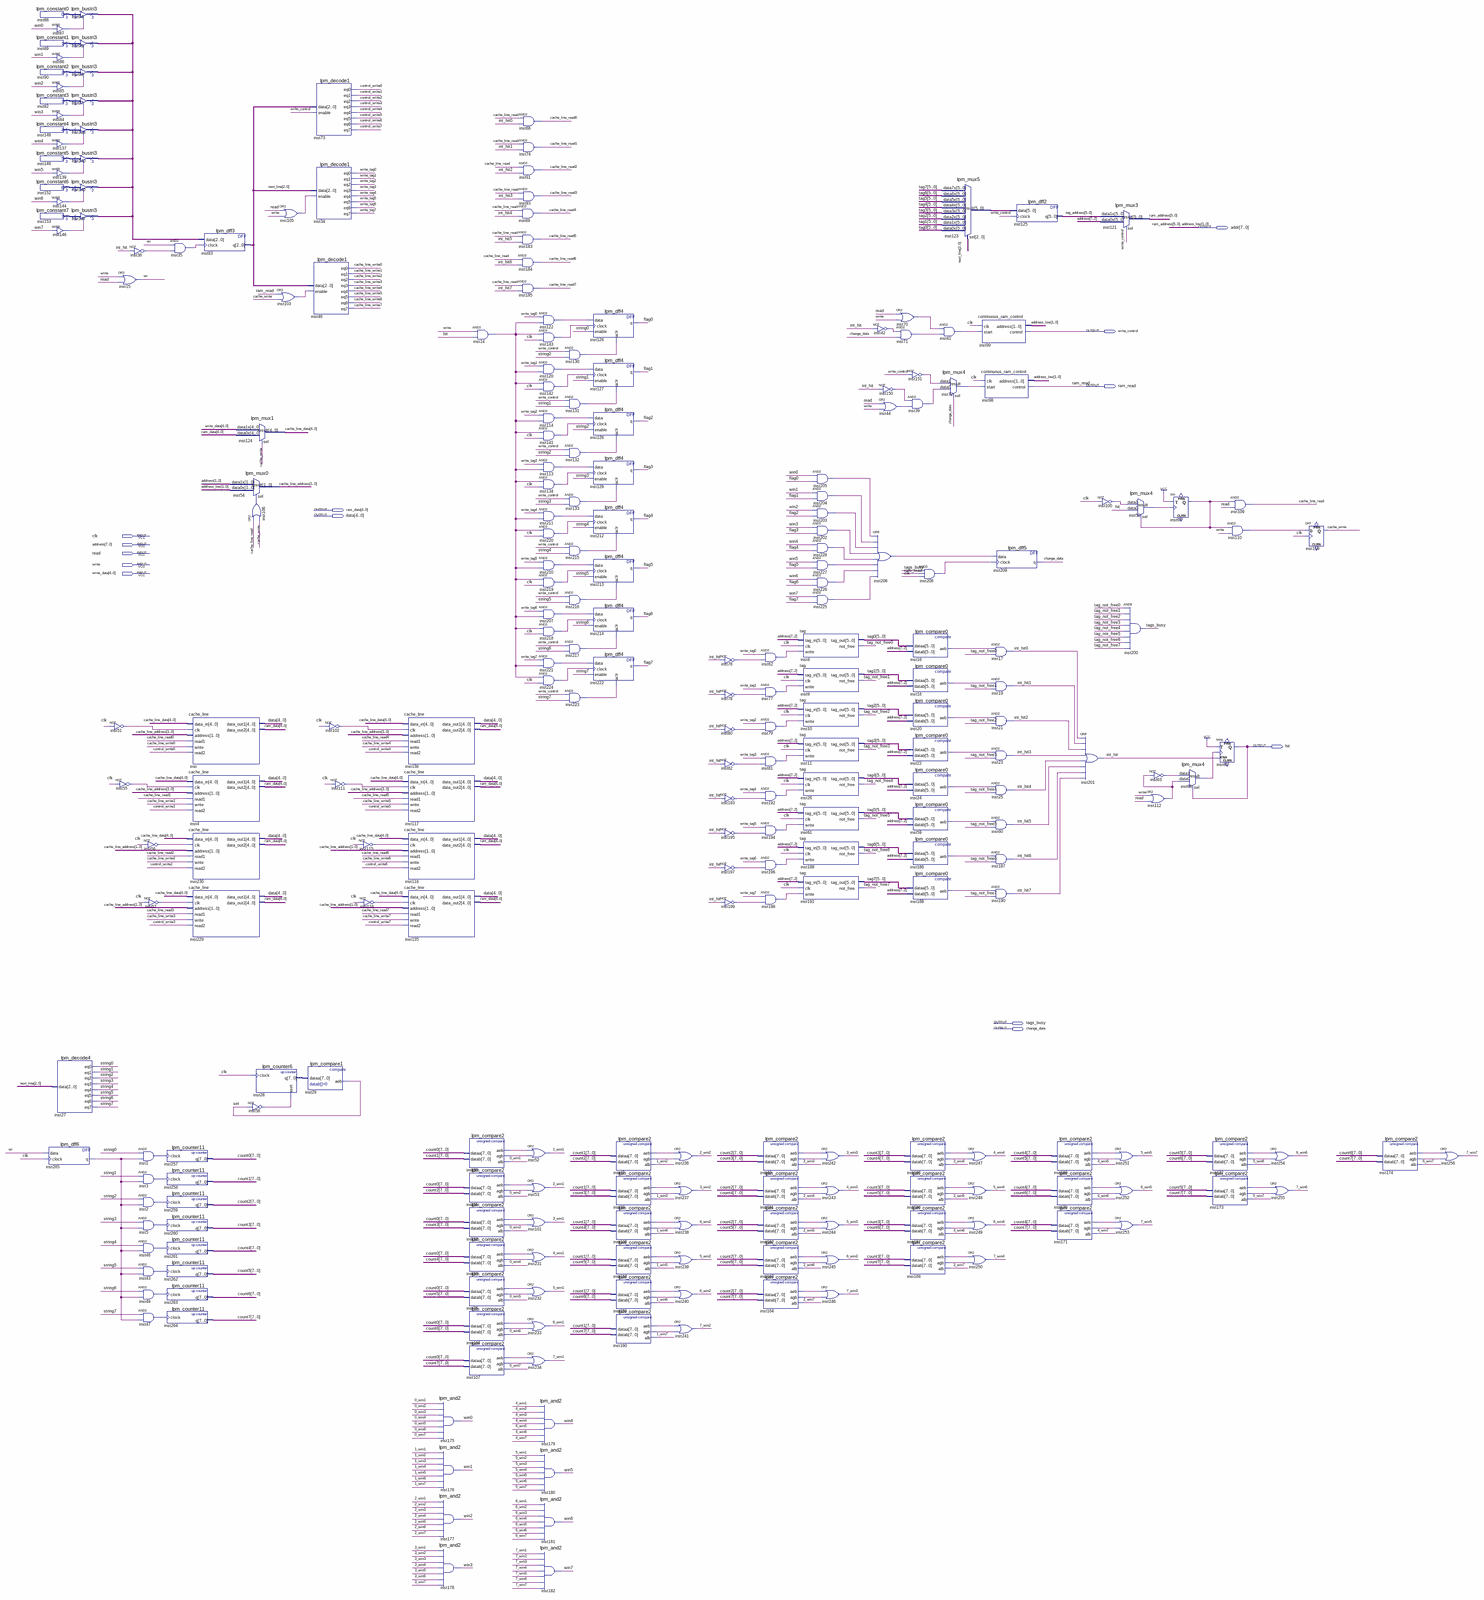
[diagram p0: schematic sheet, whole]
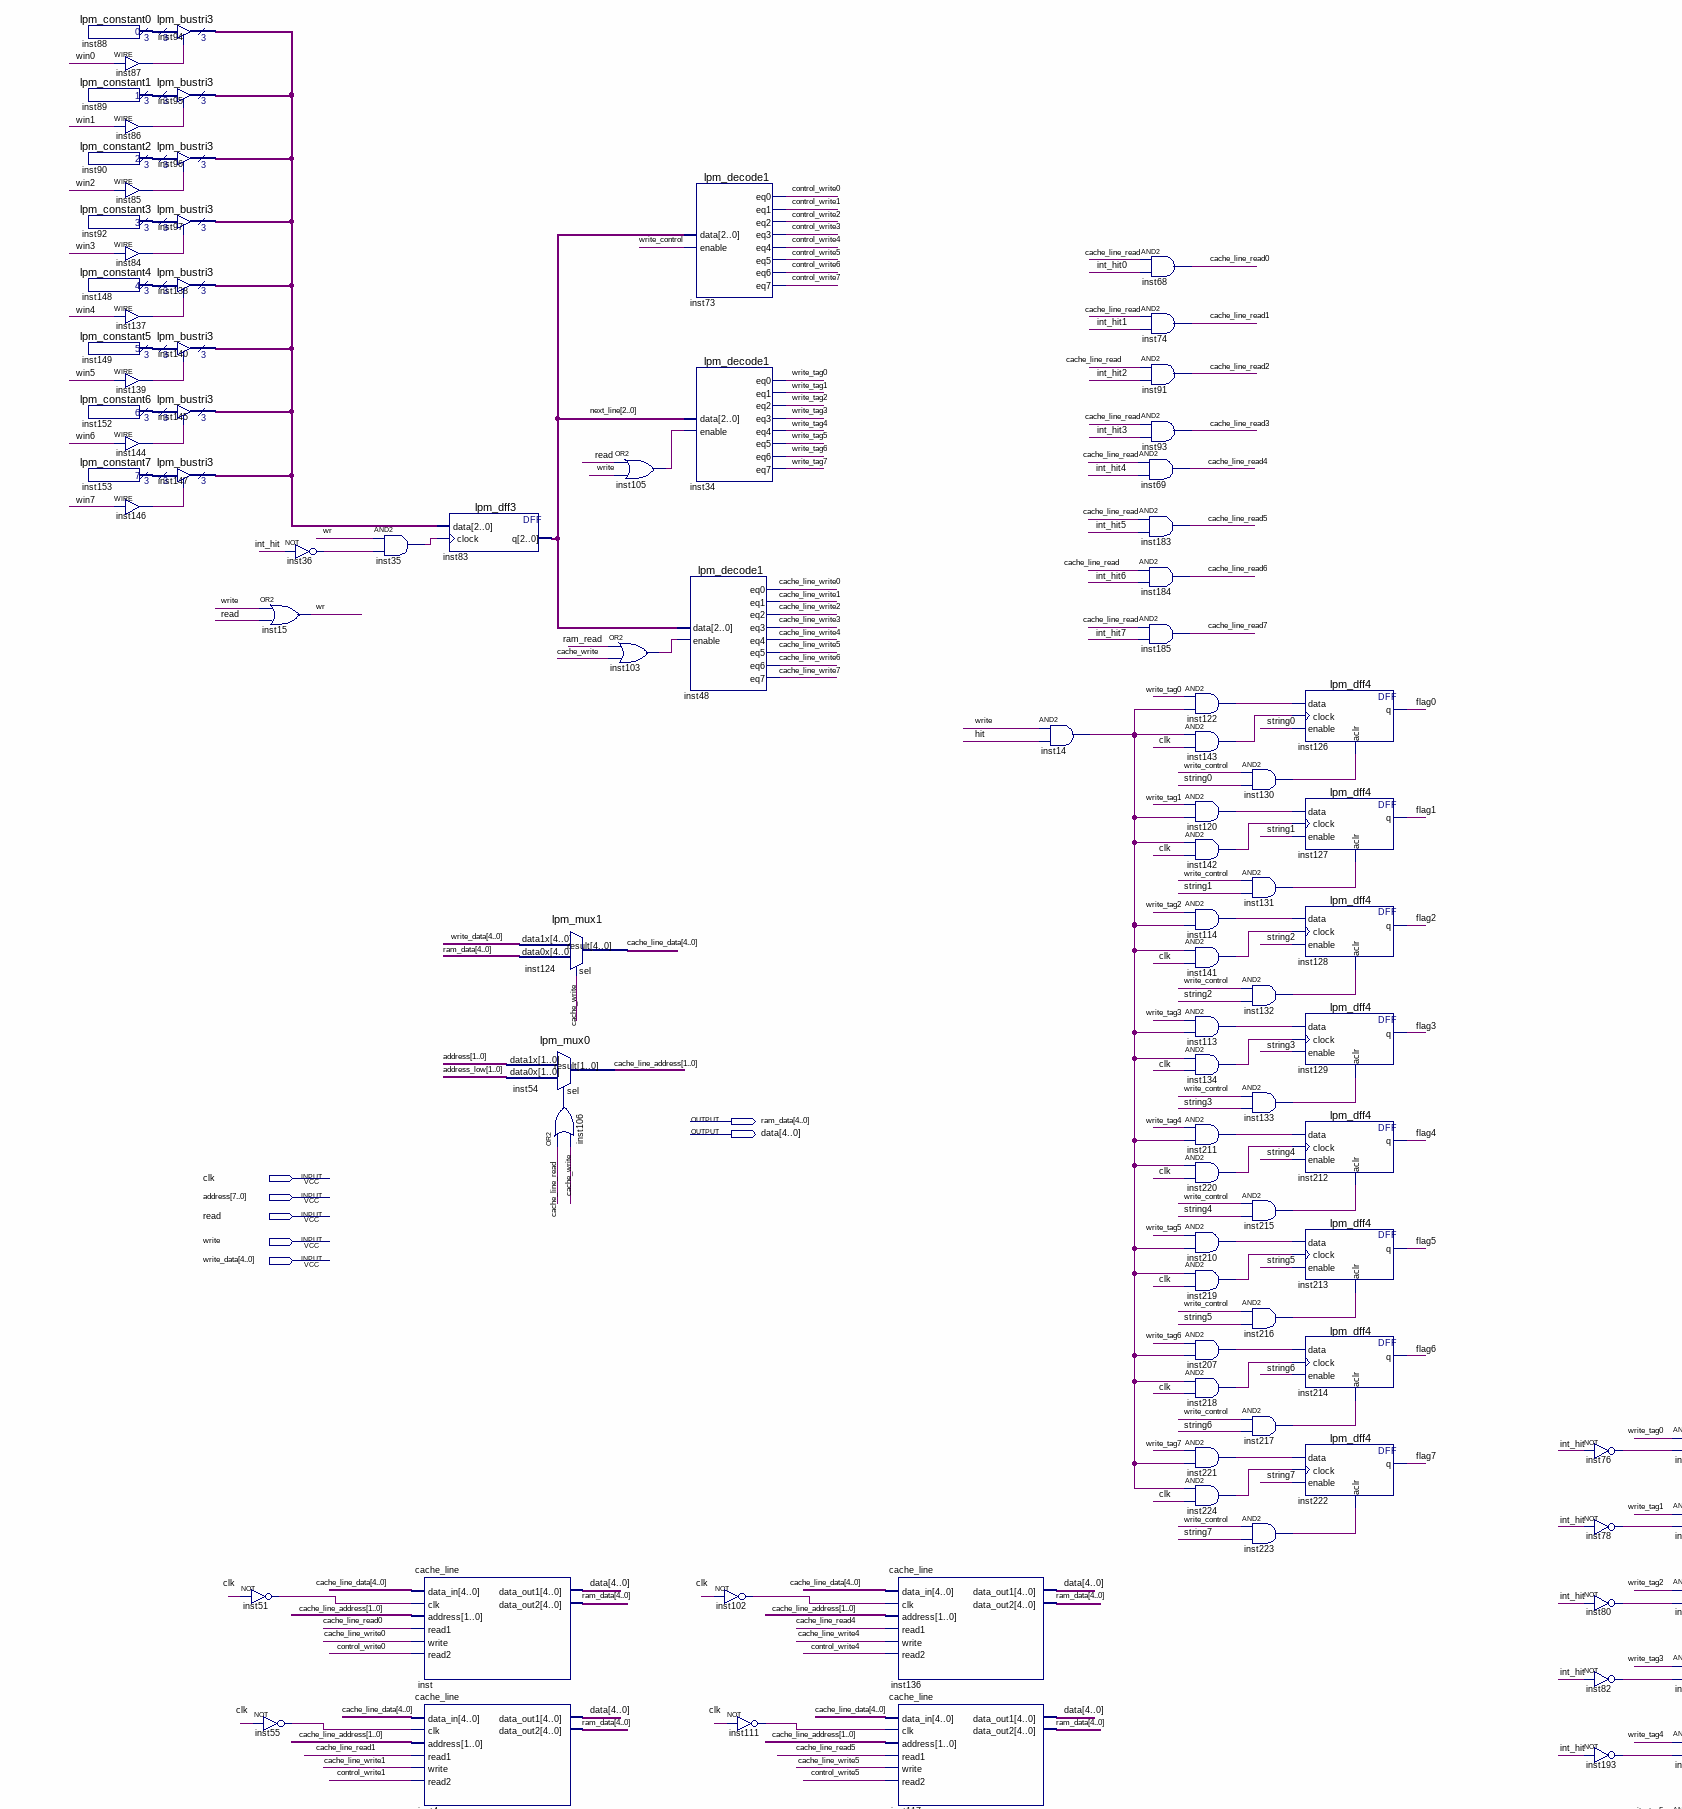
[diagram p1: schematic sheet, upper left part]
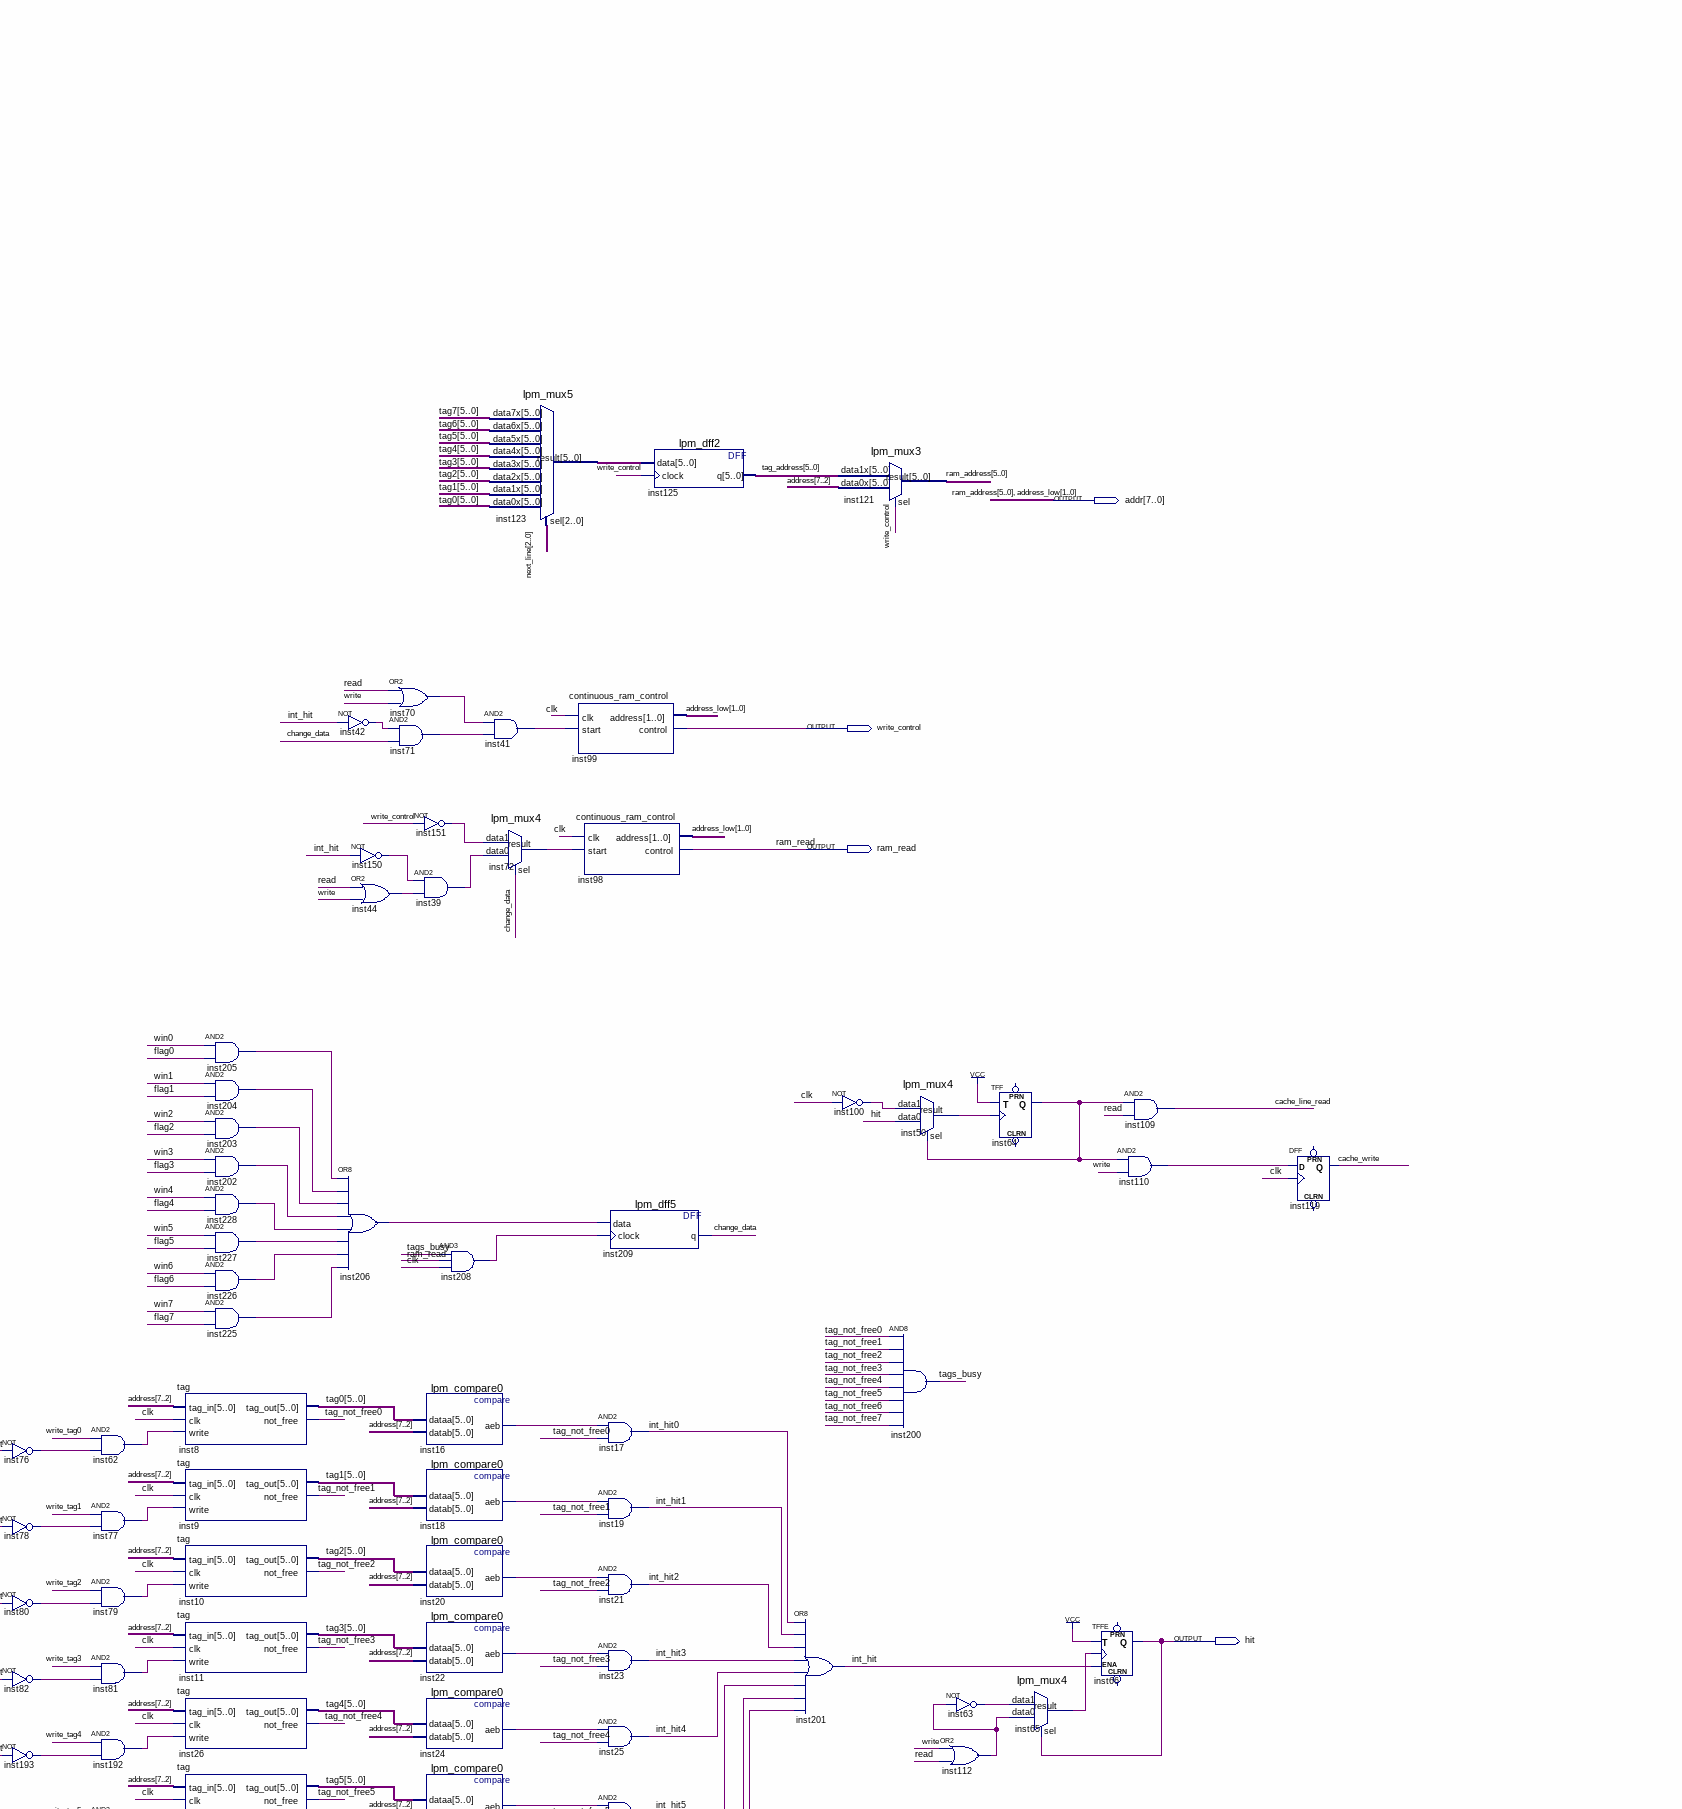
[diagram p2: schematic sheet, upper right part]
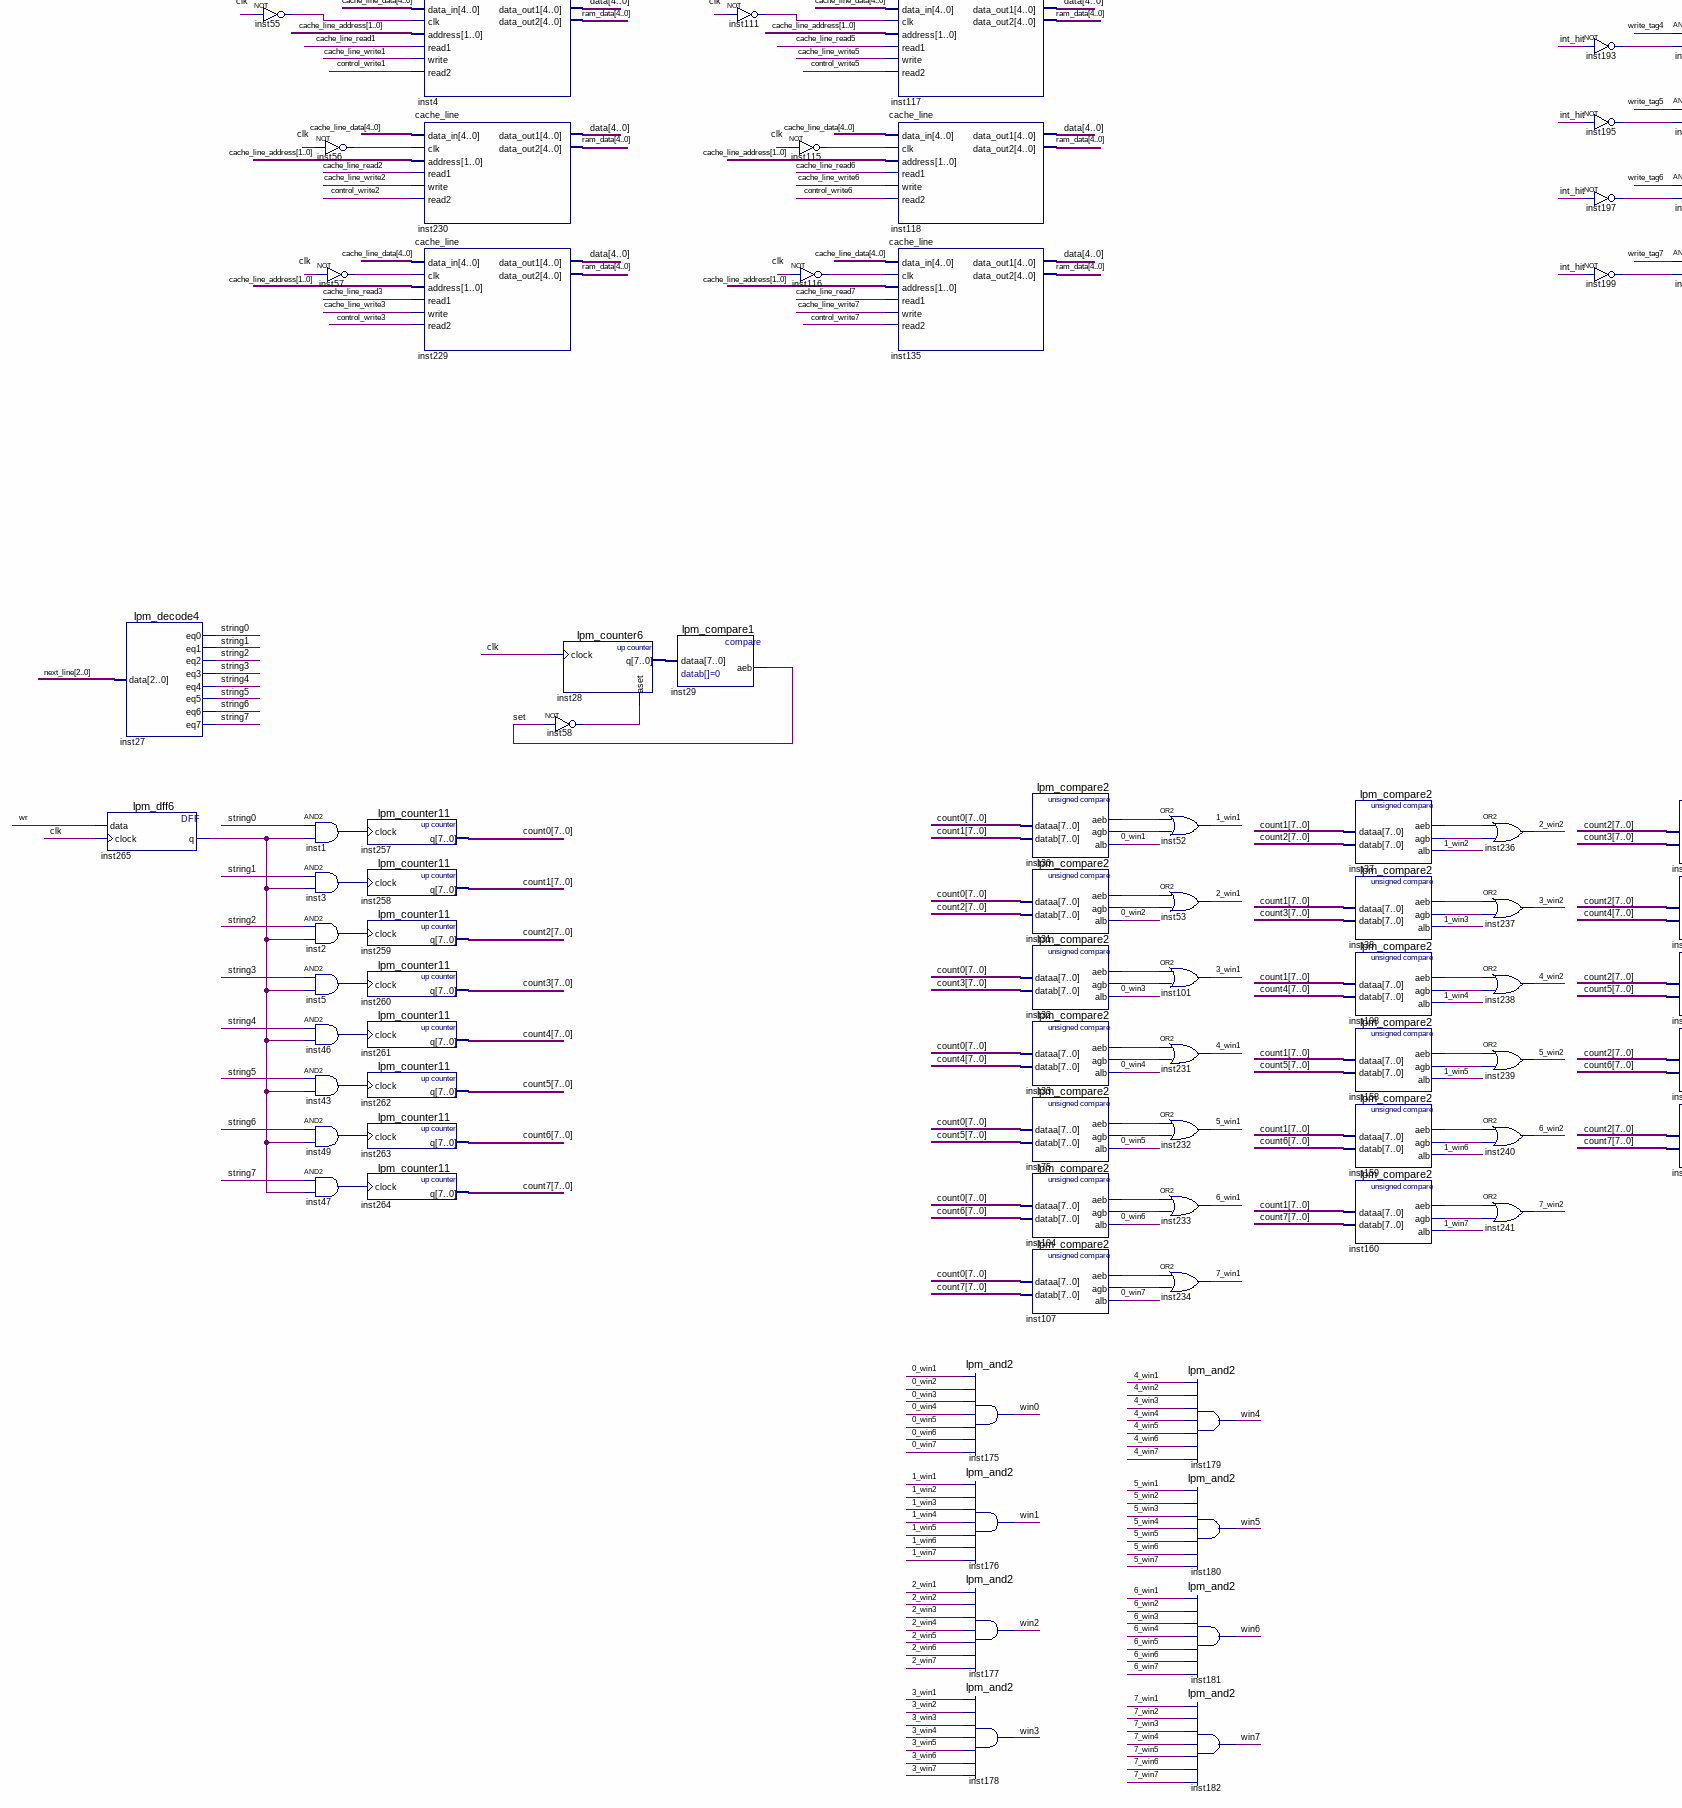
[diagram p3: schematic sheet, lower left part]
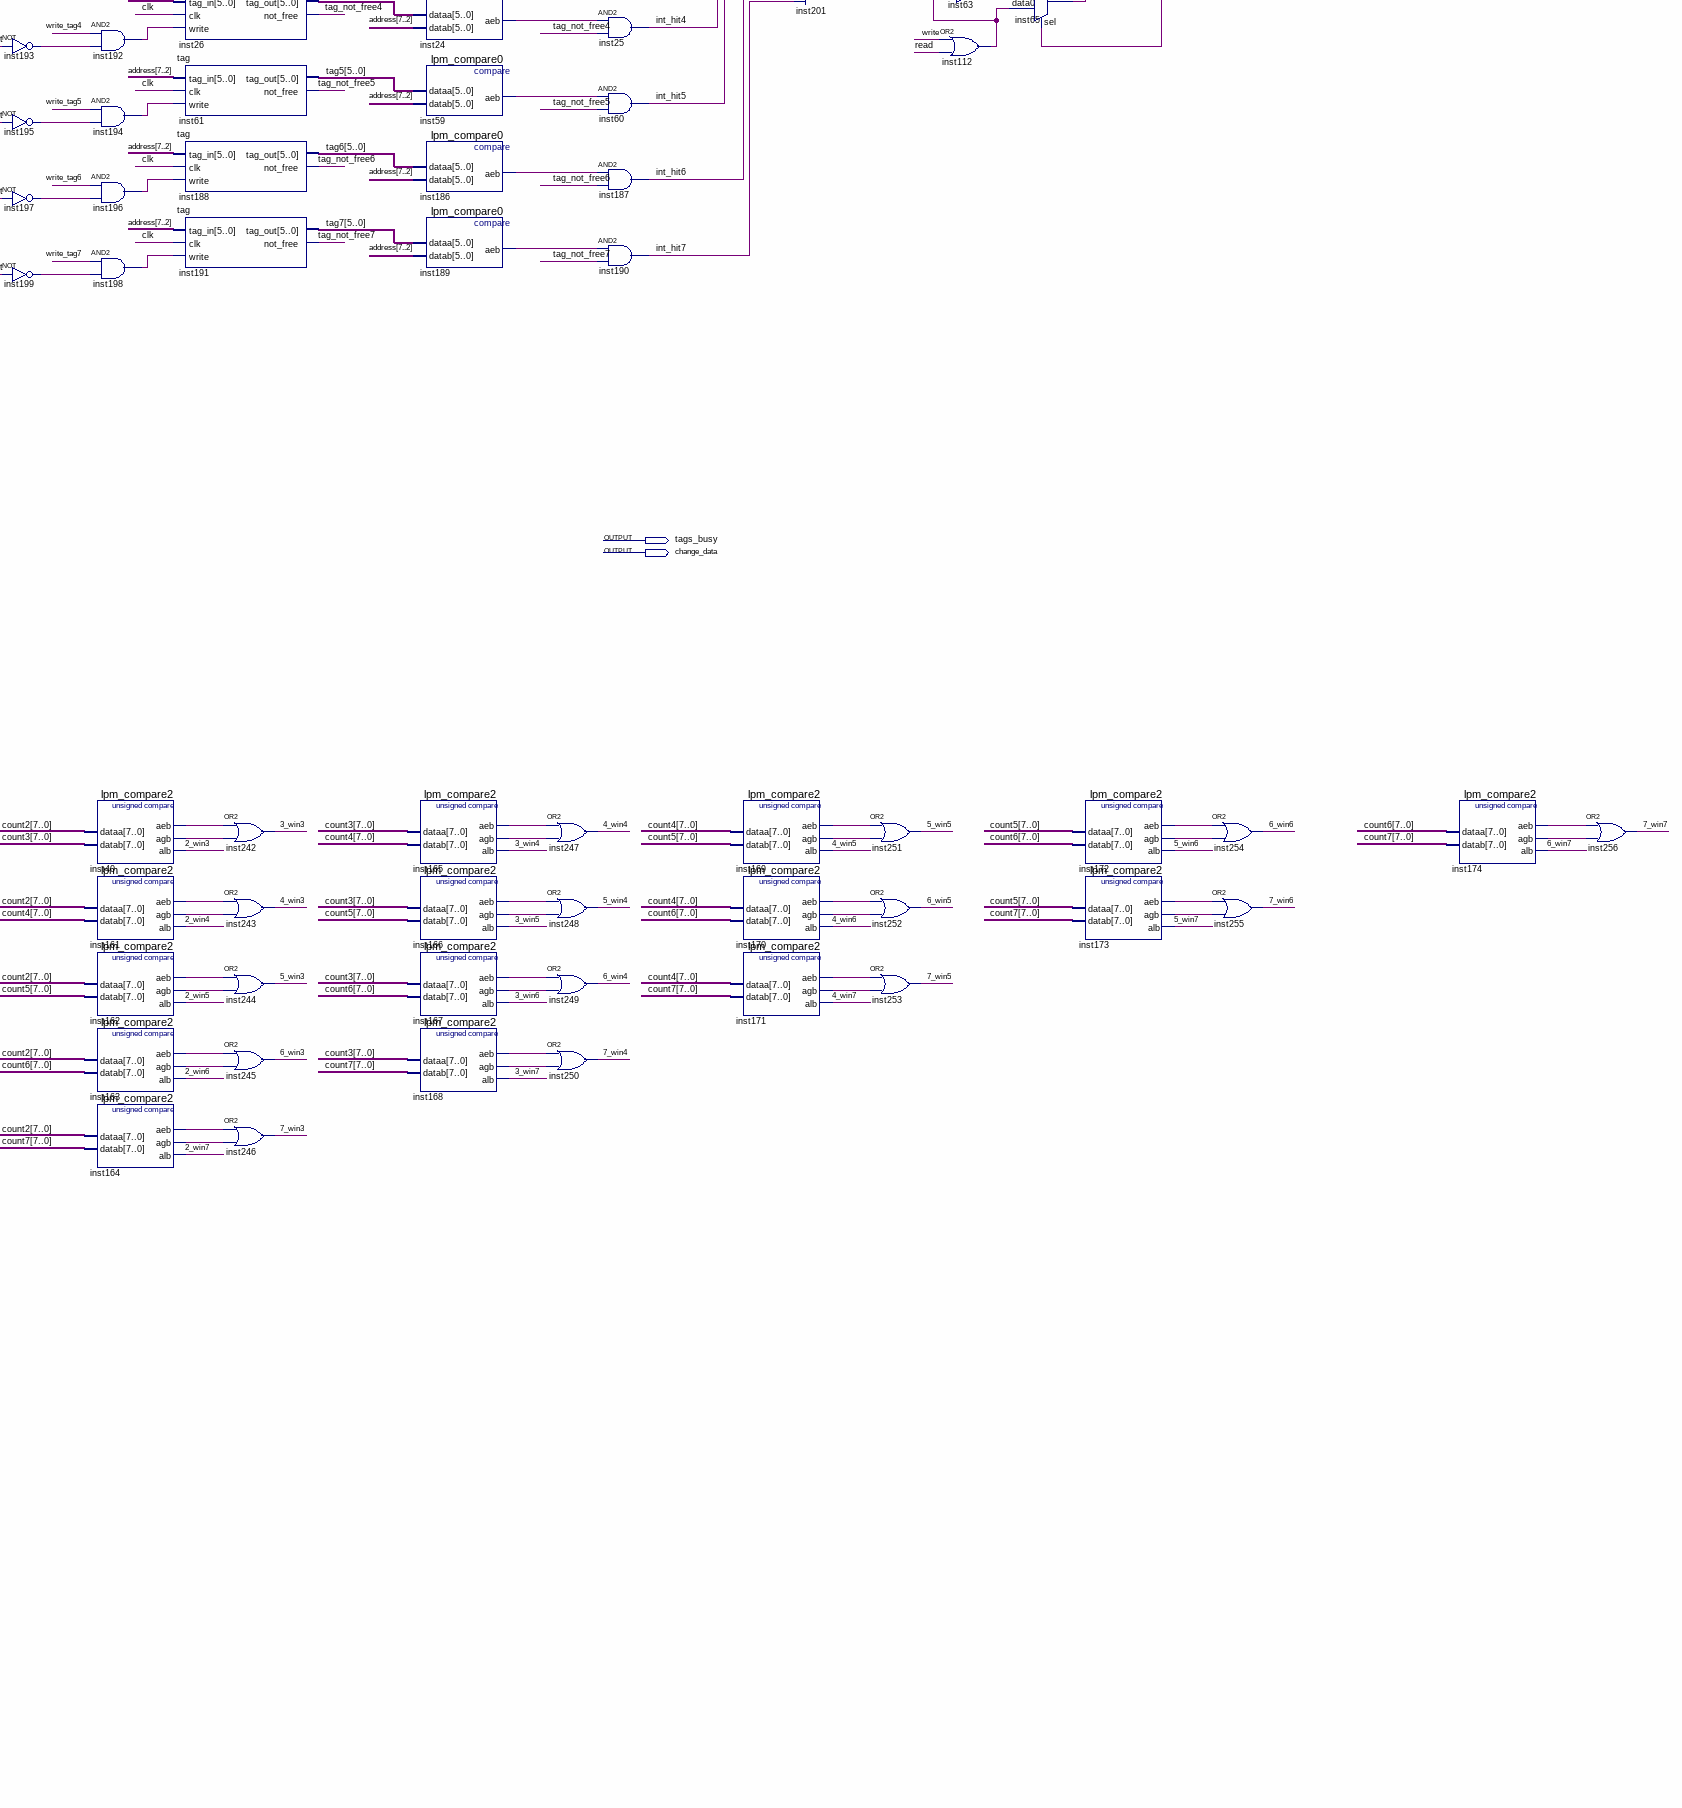
[diagram p4: schematic sheet, lower right part]
// Quartus schematic cache.bdf as structural Verilog: 255 symbols, 13 pins
module cache (
  input  clk,
  input  [7:0] address,
  input  read,
  input  write,
  input  [4:0] write_data,
  output [7:0] addr,
  output write_control,
  output ram_read,
  output [4:0] ram_data,
  output [4:0] data,
  output hit,
  output tags_busy,
  output change_data
);

  wire \0_win1 , \0_win2 , \0_win3 , \0_win4 , \0_win5 , \0_win6 , \0_win7 , \1_win1 , \1_win2 , \1_win3 ,
       \1_win4 , \1_win5 , \1_win6 , \1_win7 , \2_win1 , \2_win2 , \2_win3 , \2_win4 , \2_win5 , \2_win6 ,
       \2_win7 , \3_win1 , \3_win2 , \3_win3 , \3_win4 , \3_win5 , \3_win6 , \3_win7 , \4_win1 , \4_win2 ,
       \4_win3 , \4_win4 , \4_win5 , \4_win6 , \4_win7 , \5_win1 , \5_win2 , \5_win3 , \5_win4 , \5_win5 ,
       \5_win6 , \5_win7 , \6_win1 , \6_win2 , \6_win3 , \6_win4 , \6_win5 , \6_win6 , \6_win7 , \7_win1 ,
       \7_win2 , \7_win3 , \7_win4 , \7_win5 , \7_win6 , \7_win7 , cache_line_read, cache_line_read0,
       cache_line_read1, cache_line_read2, cache_line_read3, cache_line_read4, cache_line_read5,
       cache_line_read6, cache_line_read7, cache_line_write0, cache_line_write1, cache_line_write2,
       cache_line_write3, cache_line_write4, cache_line_write5, cache_line_write6, cache_line_write7,
       cache_write, control_write0, control_write1, control_write2, control_write3, control_write4,
       control_write5, control_write6, control_write7, flag0, flag1, flag2, flag3, flag4, flag5, flag6,
       flag7, inst1_out, inst2_out, inst3_out, inst5_out, inst14_out, inst16_aeb, inst18_aeb, inst20_aeb,
       inst22_aeb, inst24_aeb, inst30_aeb, inst30_agb, inst31_aeb, inst31_agb, inst32_aeb, inst32_agb,
       inst33_aeb, inst33_agb, inst35_out, inst36_out, inst37_aeb, inst37_agb, inst38_aeb, inst38_agb,
       inst39_out, inst40_aeb, inst40_agb, inst41_out, inst42_out, inst43_out, inst44_out, inst46_out,
       inst47_out, inst49_out, inst50_result, inst51_out, inst55_out, inst56_out, inst57_out, inst58_out,
       inst59_aeb, inst62_out, inst63_out, inst64_q, inst65_result, inst70_out, inst71_out, inst72_result,
       inst75_aeb, inst75_agb, inst76_out, inst77_out, inst78_out, inst79_out, inst80_out, inst81_out,
       inst82_out, inst84_out, inst85_out, inst86_out, inst87_out, inst100_out, inst102_out, inst103_out,
       inst104_aeb, inst104_agb, inst105_out, inst106_out, inst107_aeb, inst107_agb, inst108_aeb,
       inst108_agb, inst110_out, inst111_out, inst112_out, inst113_out, inst114_out, inst115_out,
       inst116_out, inst120_out, inst122_out, inst130_out, inst131_out, inst132_out, inst133_out,
       inst134_out, inst137_out, inst139_out, inst141_out, inst142_out, inst143_out, inst144_out,
       inst146_out, inst150_out, inst151_out, inst158_aeb, inst158_agb, inst159_aeb, inst159_agb,
       inst160_aeb, inst160_agb, inst161_aeb, inst161_agb, inst162_aeb, inst162_agb, inst163_aeb,
       inst163_agb, inst164_aeb, inst164_agb, inst165_aeb, inst165_agb, inst166_aeb, inst166_agb,
       inst167_aeb, inst167_agb, inst168_aeb, inst168_agb, inst169_aeb, inst169_agb, inst170_aeb,
       inst170_agb, inst171_aeb, inst171_agb, inst172_aeb, inst172_agb, inst173_aeb, inst173_agb,
       inst174_aeb, inst174_agb, inst186_aeb, inst189_aeb, inst192_out, inst193_out, inst194_out,
       inst195_out, inst196_out, inst197_out, inst198_out, inst199_out, inst202_out, inst203_out,
       inst204_out, inst205_out, inst206_out, inst207_out, inst208_out, inst210_out, inst211_out,
       inst215_out, inst216_out, inst217_out, inst218_out, inst219_out, inst220_out, inst221_out,
       inst223_out, inst224_out, inst225_out, inst226_out, inst227_out, inst228_out, inst265_q, int_hit,
       int_hit0, int_hit1, int_hit2, int_hit3, int_hit4, int_hit5, int_hit6, int_hit7, set, string0, string1,
       string2, string3, string4, string5, string6, string7, tag_not_free0, tag_not_free1, tag_not_free2,
       tag_not_free3, tag_not_free4, tag_not_free5, tag_not_free6, tag_not_free7, win0, win1, win2, win3,
       win4, win5, win6, win7, wr, write_tag0, write_tag1, write_tag2, write_tag3, write_tag4, write_tag5,
       write_tag6, write_tag7;
  wire [1:0] cache_line_address;
  wire [2:0] inst88_result, inst89_result, inst90_result, inst92_result, inst94_tridata, inst148_result,
       inst149_result, inst152_result, inst153_result, next_line;
  wire [4:0] cache_line_data;
  wire [5:0] inst123_result, tag0, tag1, tag2, tag3, tag4, tag5, tag6, tag7, tag_address;
  wire [7:0] count0, count1, count2, count3, count4, count5, count6, count7, inst28_q;

  lpm_constant0 inst88 (.result(inst88_result));
  lpm_constant1 inst89 (.result(inst89_result));
  lpm_constant2 inst90 (.result(inst90_result));
  lpm_constant3 inst92 (.result(inst92_result));
  lpm_constant4 inst148 (.result(inst148_result));
  lpm_constant5 inst149 (.result(inst149_result));
  lpm_constant6 inst152 (.result(inst152_result));
  lpm_constant7 inst153 (.result(inst153_result));
  assign inst87_out = win0;  // WIRE inst87
  assign inst86_out = win1;  // WIRE inst86
  assign inst85_out = win2;  // WIRE inst85
  assign inst84_out = win3;  // WIRE inst84
  assign inst137_out = win4;  // WIRE inst137
  assign inst139_out = win5;  // WIRE inst139
  assign inst144_out = win6;  // WIRE inst144
  assign inst146_out = win7;  // WIRE inst146
  lpm_decode4 inst27 (
    .data(next_line), .eq0(string0), .eq1(string1), .eq2(string2), .eq3(string3), .eq4(string4),
    .eq5(string5), .eq6(string6), .eq7(string7));
  lpm_dff6 inst265 (.data(wr), .clock(clk), .q(inst265_q));
  lpm_bustri3 inst94 (.enabledt(inst87_out), .data(inst88_result), .tridata(inst94_tridata));
  lpm_bustri3 inst95 (.enabledt(inst86_out), .data(inst89_result), .tridata(inst94_tridata));
  lpm_bustri3 inst96 (.enabledt(inst85_out), .data(inst90_result), .tridata(inst94_tridata));
  lpm_bustri3 inst97 (.enabledt(inst84_out), .data(inst92_result), .tridata(inst94_tridata));
  lpm_bustri3 inst138 (.enabledt(inst137_out), .data(inst148_result), .tridata(inst94_tridata));
  lpm_bustri3 inst140 (.enabledt(inst139_out), .data(inst149_result), .tridata(inst94_tridata));
  lpm_bustri3 inst145 (.enabledt(inst144_out), .data(inst152_result), .tridata(inst94_tridata));
  lpm_bustri3 inst147 (.enabledt(inst146_out), .data(inst153_result), .tridata(inst94_tridata));
  not inst36 (inst36_out, int_hit);
  or inst15 (wr, write, read);
  not inst51 (inst51_out, clk);
  not inst55 (inst55_out, clk);
  not inst56 (inst56_out, clk);
  not inst57 (inst57_out, clk);
  and inst1 (inst1_out, string0, inst265_q);
  and inst3 (inst3_out, string1, inst265_q);
  and inst2 (inst2_out, string2, inst265_q);
  and inst5 (inst5_out, string3, inst265_q);
  and inst46 (inst46_out, string4, inst265_q);
  and inst43 (inst43_out, string5, inst265_q);
  and inst49 (inst49_out, string6, inst265_q);
  and inst47 (inst47_out, string7, inst265_q);
  and inst35 (inst35_out, wr, inst36_out);
  lpm_counter11 inst257 (.clock(inst1_out), .q(count0));
  lpm_counter11 inst258 (.clock(inst3_out), .q(count1));
  lpm_counter11 inst259 (.clock(inst2_out), .q(count2));
  lpm_counter11 inst260 (.clock(inst5_out), .q(count3));
  lpm_counter11 inst261 (.clock(inst46_out), .q(count4));
  lpm_counter11 inst262 (.clock(inst43_out), .q(count5));
  lpm_counter11 inst263 (.clock(inst49_out), .q(count6));
  lpm_counter11 inst264 (.clock(inst47_out), .q(count7));
  lpm_dff3 inst83 (.data(inst94_tridata), .clock(inst35_out), .q(next_line));
  cache_line inst (
    .data_in(cache_line_data), .clk(inst51_out), .address(cache_line_address), .read1(cache_line_read0),
    .write(cache_line_write0), .read2(control_write0), .data_out1(data), .data_out2(ram_data));
  cache_line inst4 (
    .data_in(cache_line_data), .clk(inst55_out), .address(cache_line_address), .read1(cache_line_read1),
    .write(cache_line_write1), .read2(control_write1), .data_out1(data), .data_out2(ram_data));
  cache_line inst230 (
    .data_in(cache_line_data), .clk(inst56_out), .address(cache_line_address), .read1(cache_line_read2),
    .write(cache_line_write2), .read2(control_write2), .data_out1(data), .data_out2(ram_data));
  cache_line inst229 (
    .data_in(cache_line_data), .clk(inst57_out), .address(cache_line_address), .read1(cache_line_read3),
    .write(cache_line_write3), .read2(control_write3), .data_out1(data), .data_out2(ram_data));
  lpm_mux1 inst124 (.data1x(write_data), .data0x(ram_data), .sel(cache_write), .result(cache_line_data));
  lpm_mux0 inst54 (.data1x(address[1:0]), .data0x(addr[1:0]), .sel(inst106_out), .result(cache_line_address));
  or inst106 (inst106_out, cache_line_read, cache_write);
  lpm_counter6 inst28 (.clock(clk), .aset(inst58_out), .q(inst28_q));
  not inst58 (inst58_out, set);
  or inst105 (inst105_out, read, write);
  or inst103 (inst103_out, ram_read, cache_write);
  lpm_decode1 inst73 (
    .data(next_line), .enable(write_control), .eq0(control_write0), .eq1(control_write1),
    .eq2(control_write2), .eq3(control_write3), .eq4(control_write4), .eq5(control_write5),
    .eq6(control_write6), .eq7(control_write7));
  lpm_decode1 inst34 (
    .data(next_line), .enable(inst105_out), .eq0(write_tag0), .eq1(write_tag1), .eq2(write_tag2),
    .eq3(write_tag3), .eq4(write_tag4), .eq5(write_tag5), .eq6(write_tag6), .eq7(write_tag7));
  lpm_decode1 inst48 (
    .data(next_line), .enable(inst103_out), .eq0(cache_line_write0), .eq1(cache_line_write1),
    .eq2(cache_line_write2), .eq3(cache_line_write3), .eq4(cache_line_write4), .eq5(cache_line_write5),
    .eq6(cache_line_write6), .eq7(cache_line_write7));
  lpm_compare1 inst29 (.dataa(inst28_q), .aeb(set));
  not inst102 (inst102_out, clk);
  not inst111 (inst111_out, clk);
  not inst115 (inst115_out, clk);
  not inst116 (inst116_out, clk);
  cache_line inst136 (
    .data_in(cache_line_data), .clk(inst102_out), .address(cache_line_address), .read1(cache_line_read4),
    .write(cache_line_write4), .read2(control_write4), .data_out1(data), .data_out2(ram_data));
  cache_line inst117 (
    .data_in(cache_line_data), .clk(inst111_out), .address(cache_line_address), .read1(cache_line_read5),
    .write(cache_line_write5), .read2(control_write5), .data_out1(data), .data_out2(ram_data));
  cache_line inst118 (
    .data_in(cache_line_data), .clk(inst115_out), .address(cache_line_address), .read1(cache_line_read6),
    .write(cache_line_write6), .read2(control_write6), .data_out1(data), .data_out2(ram_data));
  cache_line inst135 (
    .data_in(cache_line_data), .clk(inst116_out), .address(cache_line_address), .read1(cache_line_read7),
    .write(cache_line_write7), .read2(control_write7), .data_out1(data), .data_out2(ram_data));
  lpm_and2 inst175 (
    .data0(\0_win1 ), .data1(\0_win2 ), .data2(\0_win3 ), .data3(\0_win4 ), .data4(\0_win5 ),
    .data5(\0_win6 ), .data6(\0_win7 ), .result(win0));
  lpm_and2 inst176 (
    .data0(\1_win1 ), .data1(\1_win2 ), .data2(\1_win3 ), .data3(\1_win4 ), .data4(\1_win5 ),
    .data5(\1_win6 ), .data6(\1_win7 ), .result(win1));
  lpm_and2 inst177 (
    .data0(\2_win1 ), .data1(\2_win2 ), .data2(\2_win3 ), .data3(\2_win4 ), .data4(\2_win5 ),
    .data5(\2_win6 ), .data6(\2_win7 ), .result(win2));
  lpm_and2 inst178 (
    .data0(\3_win1 ), .data1(\3_win2 ), .data2(\3_win3 ), .data3(\3_win4 ), .data4(\3_win5 ),
    .data5(\3_win6 ), .data6(\3_win7 ), .result(win3));
  and inst14 (inst14_out, write, hit);
  lpm_compare2 inst30 (.dataa(count0), .datab(count1), .aeb(inst30_aeb), .agb(inst30_agb), .alb(\0_win1 ));
  lpm_compare2 inst31 (.dataa(count0), .datab(count2), .aeb(inst31_aeb), .agb(inst31_agb), .alb(\0_win2 ));
  lpm_compare2 inst32 (.dataa(count0), .datab(count3), .aeb(inst32_aeb), .agb(inst32_agb), .alb(\0_win3 ));
  lpm_compare2 inst33 (.dataa(count0), .datab(count4), .aeb(inst33_aeb), .agb(inst33_agb), .alb(\0_win4 ));
  lpm_compare2 inst75 (.dataa(count0), .datab(count5), .aeb(inst75_aeb), .agb(inst75_agb), .alb(\0_win5 ));
  lpm_compare2 inst104 (.dataa(count0), .datab(count6), .aeb(inst104_aeb), .agb(inst104_agb), .alb(\0_win6 ));
  lpm_compare2 inst107 (.dataa(count0), .datab(count7), .aeb(inst107_aeb), .agb(inst107_agb), .alb(\0_win7 ));
  and inst68 (cache_line_read0, cache_line_read, int_hit0);
  and inst74 (cache_line_read1, cache_line_read, int_hit1);
  and inst91 (cache_line_read2, cache_line_read, int_hit2);
  and inst93 (cache_line_read3, cache_line_read, int_hit3);
  and inst69 (cache_line_read4, cache_line_read, int_hit4);
  and inst183 (cache_line_read5, cache_line_read, int_hit5);
  and inst184 (cache_line_read6, cache_line_read, int_hit6);
  and inst185 (cache_line_read7, cache_line_read, int_hit7);
  and inst122 (inst122_out, write_tag0, inst14_out);
  and inst143 (inst143_out, inst14_out, clk);
  and inst120 (inst120_out, write_tag1, inst14_out);
  and inst142 (inst142_out, inst14_out, clk);
  and inst114 (inst114_out, write_tag2, inst14_out);
  and inst141 (inst141_out, inst14_out, clk);
  and inst113 (inst113_out, write_tag3, inst14_out);
  and inst134 (inst134_out, inst14_out, clk);
  and inst211 (inst211_out, write_tag4, inst14_out);
  and inst220 (inst220_out, inst14_out, clk);
  and inst210 (inst210_out, write_tag5, inst14_out);
  and inst219 (inst219_out, inst14_out, clk);
  and inst207 (inst207_out, write_tag6, inst14_out);
  and inst218 (inst218_out, inst14_out, clk);
  and inst221 (inst221_out, write_tag7, inst14_out);
  and inst224 (inst224_out, inst14_out, clk);
  or inst52 (\1_win1 , inst30_aeb, inst30_agb);
  or inst53 (\2_win1 , inst31_aeb, inst31_agb);
  or inst101 (\3_win1 , inst32_aeb, inst32_agb);
  or inst231 (\4_win1 , inst33_aeb, inst33_agb);
  or inst232 (\5_win1 , inst75_aeb, inst75_agb);
  or inst233 (\6_win1 , inst104_aeb, inst104_agb);
  or inst234 (\7_win1 , inst107_aeb, inst107_agb);
  lpm_and2 inst179 (
    .data0(\4_win1 ), .data1(\4_win2 ), .data2(\4_win3 ), .data3(\4_win4 ), .data4(\4_win5 ),
    .data5(\4_win6 ), .data6(\4_win7 ), .result(win4));
  lpm_and2 inst180 (
    .data0(\5_win1 ), .data1(\5_win2 ), .data2(\5_win3 ), .data3(\5_win4 ), .data4(\5_win5 ),
    .data5(\5_win6 ), .data6(\5_win7 ), .result(win5));
  lpm_and2 inst181 (
    .data0(\6_win1 ), .data1(\6_win2 ), .data2(\6_win3 ), .data3(\6_win4 ), .data4(\6_win5 ),
    .data5(\6_win6 ), .data6(\6_win7 ), .result(win6));
  lpm_and2 inst182 (
    .data0(\7_win1 ), .data1(\7_win2 ), .data2(\7_win3 ), .data3(\7_win4 ), .data4(\7_win5 ),
    .data5(\7_win6 ), .data6(\7_win7 ), .result(win7));
  and inst130 (inst130_out, write_control, string0);
  and inst131 (inst131_out, write_control, string1);
  and inst132 (inst132_out, write_control, string2);
  and inst133 (inst133_out, write_control, string3);
  and inst215 (inst215_out, write_control, string4);
  and inst216 (inst216_out, write_control, string5);
  and inst217 (inst217_out, write_control, string6);
  and inst223 (inst223_out, write_control, string7);
  lpm_dff4 inst126 (.data(inst122_out), .clock(inst143_out), .enable(string0), .aclr(inst130_out), .q(flag0));
  lpm_dff4 inst127 (.data(inst120_out), .clock(inst142_out), .enable(string1), .aclr(inst131_out), .q(flag1));
  lpm_dff4 inst128 (.data(inst114_out), .clock(inst141_out), .enable(string2), .aclr(inst132_out), .q(flag2));
  lpm_dff4 inst129 (.data(inst113_out), .clock(inst134_out), .enable(string3), .aclr(inst133_out), .q(flag3));
  lpm_dff4 inst212 (.data(inst211_out), .clock(inst220_out), .enable(string4), .aclr(inst215_out), .q(flag4));
  lpm_dff4 inst213 (.data(inst210_out), .clock(inst219_out), .enable(string5), .aclr(inst216_out), .q(flag5));
  lpm_dff4 inst214 (.data(inst207_out), .clock(inst218_out), .enable(string6), .aclr(inst217_out), .q(flag6));
  lpm_dff4 inst222 (.data(inst221_out), .clock(inst224_out), .enable(string7), .aclr(inst223_out), .q(flag7));
  lpm_compare2 inst37 (.dataa(count1), .datab(count2), .aeb(inst37_aeb), .agb(inst37_agb), .alb(\1_win2 ));
  lpm_compare2 inst38 (.dataa(count1), .datab(count3), .aeb(inst38_aeb), .agb(inst38_agb), .alb(\1_win3 ));
  lpm_compare2 inst108 (.dataa(count1), .datab(count4), .aeb(inst108_aeb), .agb(inst108_agb), .alb(\1_win4 ));
  lpm_compare2 inst158 (.dataa(count1), .datab(count5), .aeb(inst158_aeb), .agb(inst158_agb), .alb(\1_win5 ));
  lpm_compare2 inst159 (.dataa(count1), .datab(count6), .aeb(inst159_aeb), .agb(inst159_agb), .alb(\1_win6 ));
  lpm_compare2 inst160 (.dataa(count1), .datab(count7), .aeb(inst160_aeb), .agb(inst160_agb), .alb(\1_win7 ));
  or inst236 (\2_win2 , inst37_aeb, inst37_agb);
  or inst237 (\3_win2 , inst38_aeb, inst38_agb);
  or inst238 (\4_win2 , inst108_aeb, inst108_agb);
  or inst239 (\5_win2 , inst158_aeb, inst158_agb);
  or inst240 (\6_win2 , inst159_aeb, inst159_agb);
  or inst241 (\7_win2 , inst160_aeb, inst160_agb);
  not inst76 (inst76_out, int_hit);
  not inst78 (inst78_out, int_hit);
  not inst80 (inst80_out, int_hit);
  not inst82 (inst82_out, int_hit);
  not inst193 (inst193_out, int_hit);
  not inst195 (inst195_out, int_hit);
  not inst197 (inst197_out, int_hit);
  not inst199 (inst199_out, int_hit);
  and inst62 (inst62_out, write_tag0, inst76_out);
  and inst77 (inst77_out, write_tag1, inst78_out);
  and inst79 (inst79_out, write_tag2, inst80_out);
  and inst81 (inst81_out, write_tag3, inst82_out);
  and inst192 (inst192_out, write_tag4, inst193_out);
  and inst194 (inst194_out, write_tag5, inst195_out);
  and inst196 (inst196_out, write_tag6, inst197_out);
  and inst198 (inst198_out, write_tag7, inst199_out);
  lpm_compare2 inst40 (.dataa(count2), .datab(count3), .aeb(inst40_aeb), .agb(inst40_agb), .alb(\2_win3 ));
  lpm_compare2 inst161 (.dataa(count2), .datab(count4), .aeb(inst161_aeb), .agb(inst161_agb), .alb(\2_win4 ));
  lpm_compare2 inst162 (.dataa(count2), .datab(count5), .aeb(inst162_aeb), .agb(inst162_agb), .alb(\2_win5 ));
  lpm_compare2 inst163 (.dataa(count2), .datab(count6), .aeb(inst163_aeb), .agb(inst163_agb), .alb(\2_win6 ));
  lpm_compare2 inst164 (.dataa(count2), .datab(count7), .aeb(inst164_aeb), .agb(inst164_agb), .alb(\2_win7 ));
  tag inst8 (.tag_in(address[7:2]), .clk(clk), .write(inst62_out), .tag_out(tag0), .not_free(tag_not_free0));
  tag inst9 (.tag_in(address[7:2]), .clk(clk), .write(inst77_out), .tag_out(tag1), .not_free(tag_not_free1));
  tag inst10 (.tag_in(address[7:2]), .clk(clk), .write(inst79_out), .tag_out(tag2), .not_free(tag_not_free2));
  tag inst11 (.tag_in(address[7:2]), .clk(clk), .write(inst81_out), .tag_out(tag3), .not_free(tag_not_free3));
  tag inst26 (.tag_in(address[7:2]), .clk(clk), .write(inst192_out), .tag_out(tag4), .not_free(tag_not_free4));
  tag inst61 (.tag_in(address[7:2]), .clk(clk), .write(inst194_out), .tag_out(tag5), .not_free(tag_not_free5));
  tag inst188 (.tag_in(address[7:2]), .clk(clk), .write(inst196_out), .tag_out(tag6), .not_free(tag_not_free6));
  tag inst191 (.tag_in(address[7:2]), .clk(clk), .write(inst198_out), .tag_out(tag7), .not_free(tag_not_free7));
  and inst205 (inst205_out, win0, flag0);
  and inst204 (inst204_out, win1, flag1);
  and inst203 (inst203_out, win2, flag2);
  and inst202 (inst202_out, win3, flag3);
  and inst228 (inst228_out, win4, flag4);
  and inst227 (inst227_out, win5, flag5);
  and inst226 (inst226_out, win6, flag6);
  and inst225 (inst225_out, win7, flag7);
  or inst242 (\3_win3 , inst40_aeb, inst40_agb);
  or inst243 (\4_win3 , inst161_aeb, inst161_agb);
  or inst244 (\5_win3 , inst162_aeb, inst162_agb);
  or inst245 (\6_win3 , inst163_aeb, inst163_agb);
  or inst246 (\7_win3 , inst164_aeb, inst164_agb);
  not inst42 (inst42_out, int_hit);
  not inst150 (inst150_out, int_hit);
  or inst44 (inst44_out, read, write);
  or inst206 (inst206_out, inst205_out, inst204_out, inst203_out, inst202_out, inst228_out, inst227_out, inst226_out, inst225_out);
  or inst70 (inst70_out, read, write);
  and inst71 (inst71_out, inst42_out, change_data);
  not inst151 (inst151_out, write_control);
  and inst39 (inst39_out, inst150_out, inst44_out);
  lpm_compare0 inst16 (.dataa(tag0), .datab(address[7:2]), .aeb(inst16_aeb));
  lpm_compare0 inst18 (.dataa(tag1), .datab(address[7:2]), .aeb(inst18_aeb));
  lpm_compare0 inst20 (.dataa(tag2), .datab(address[7:2]), .aeb(inst20_aeb));
  lpm_compare0 inst22 (.dataa(tag3), .datab(address[7:2]), .aeb(inst22_aeb));
  lpm_compare0 inst24 (.dataa(tag4), .datab(address[7:2]), .aeb(inst24_aeb));
  lpm_compare0 inst59 (.dataa(tag5), .datab(address[7:2]), .aeb(inst59_aeb));
  lpm_compare0 inst186 (.dataa(tag6), .datab(address[7:2]), .aeb(inst186_aeb));
  lpm_compare0 inst189 (.dataa(tag7), .datab(address[7:2]), .aeb(inst189_aeb));
  lpm_compare2 inst165 (.dataa(count3), .datab(count4), .aeb(inst165_aeb), .agb(inst165_agb), .alb(\3_win4 ));
  lpm_compare2 inst166 (.dataa(count3), .datab(count5), .aeb(inst166_aeb), .agb(inst166_agb), .alb(\3_win5 ));
  lpm_compare2 inst167 (.dataa(count3), .datab(count6), .aeb(inst167_aeb), .agb(inst167_agb), .alb(\3_win6 ));
  lpm_compare2 inst168 (.dataa(count3), .datab(count7), .aeb(inst168_aeb), .agb(inst168_agb), .alb(\3_win7 ));
  and inst208 (inst208_out, tags_busy, ram_read, clk);
  lpm_mux5 inst123 (
    .data7x(tag7), .data6x(tag6), .data5x(tag5), .data4x(tag4), .data3x(tag3), .data2x(tag2), .data1x(tag1),
    .data0x(tag0), .sel(next_line), .result(inst123_result));
  and inst41 (inst41_out, inst70_out, inst71_out);
  lpm_mux4 inst72 (.data1(inst151_out), .data0(inst39_out), .sel(change_data), .result(inst72_result));
  continuous_ram_control inst99 (.clk(clk), .start(inst41_out), .address(addr[1:0]), .control(write_control));
  continuous_ram_control inst98 (.clk(clk), .start(inst72_result), .address(addr[1:0]), .control(ram_read));
  or inst247 (\4_win4 , inst165_aeb, inst165_agb);
  or inst248 (\5_win4 , inst166_aeb, inst166_agb);
  or inst249 (\6_win4 , inst167_aeb, inst167_agb);
  or inst250 (\7_win4 , inst168_aeb, inst168_agb);
  lpm_dff5 inst209 (.data(inst206_out), .clock(inst208_out), .q(change_data));
  and inst17 (int_hit0, inst16_aeb, tag_not_free0);
  and inst19 (int_hit1, inst18_aeb, tag_not_free1);
  and inst21 (int_hit2, inst20_aeb, tag_not_free2);
  and inst23 (int_hit3, inst22_aeb, tag_not_free3);
  and inst25 (int_hit4, inst24_aeb, tag_not_free4);
  and inst60 (int_hit5, inst59_aeb, tag_not_free5);
  and inst187 (int_hit6, inst186_aeb, tag_not_free6);
  and inst190 (int_hit7, inst189_aeb, tag_not_free7);
  lpm_dff2 inst125 (.data(inst123_result), .clock(write_control), .q(tag_address));
  lpm_compare2 inst169 (.dataa(count4), .datab(count5), .aeb(inst169_aeb), .agb(inst169_agb), .alb(\4_win5 ));
  lpm_compare2 inst170 (.dataa(count4), .datab(count6), .aeb(inst170_aeb), .agb(inst170_agb), .alb(\4_win6 ));
  lpm_compare2 inst171 (.dataa(count4), .datab(count7), .aeb(inst171_aeb), .agb(inst171_agb), .alb(\4_win7 ));
  not inst100 (inst100_out, clk);
  or inst201 (int_hit, int_hit0, int_hit1, int_hit2, int_hit3, int_hit4, int_hit5, int_hit6, int_hit7);
  lpm_mux3 inst121 (.data1x(tag_address), .data0x(address[7:2]), .sel(write_control), .result(addr[7:2]));
  or inst251 (\5_win5 , inst169_aeb, inst169_agb);
  or inst252 (\6_win5 , inst170_aeb, inst170_agb);
  or inst253 (\7_win5 , inst171_aeb, inst171_agb);
  lpm_mux4 inst50 (.data1(inst100_out), .data0(hit), .sel(inst64_q), .result(inst50_result));
  and inst200 (tags_busy, tag_not_free0, tag_not_free1, tag_not_free2, tag_not_free3, tag_not_free4, tag_not_free5, tag_not_free6, tag_not_free7);
  not inst63 (inst63_out, inst112_out);
  or inst112 (inst112_out, write, read);
  TFF inst64 (.T(1'b1), .CLK(inst50_result), .Q(inst64_q));  // open: PRN, CLRN
  lpm_mux4 inst65 (.data1(inst63_out), .data0(inst112_out), .sel(hit), .result(inst65_result));
  lpm_compare2 inst172 (.dataa(count5), .datab(count6), .aeb(inst172_aeb), .agb(inst172_agb), .alb(\5_win6 ));
  lpm_compare2 inst173 (.dataa(count5), .datab(count7), .aeb(inst173_aeb), .agb(inst173_agb), .alb(\5_win7 ));
  and inst109 (cache_line_read, inst64_q, read);
  and inst110 (inst110_out, inst64_q, write);
  TFFE inst66 (.T(1'b1), .CLK(inst65_result), .ENA(int_hit), .Q(hit));  // open: CLRN, PRN
  or inst254 (\6_win6 , inst172_aeb, inst172_agb);
  or inst255 (\7_win6 , inst173_aeb, inst173_agb);
  DFF inst119 (.CLK(clk), .D(inst110_out), .Q(cache_write));  // open: CLRN, PRN
  lpm_compare2 inst174 (.dataa(count6), .datab(count7), .aeb(inst174_aeb), .agb(inst174_agb), .alb(\6_win7 ));
  or inst256 (\7_win7 , inst174_aeb, inst174_agb);

  // Other names for the same wires on the sheet: address_low[1:0] = addr[1:0]; ram_address[5:0] = addr[7:2]
endmodule
